# Altium schematic sheet EFR32BG24_PartA.SchDoc: LPEDT_Project_Schematic
size A; Revision: 1; SheetNumber: 7; SheetTotal: 7
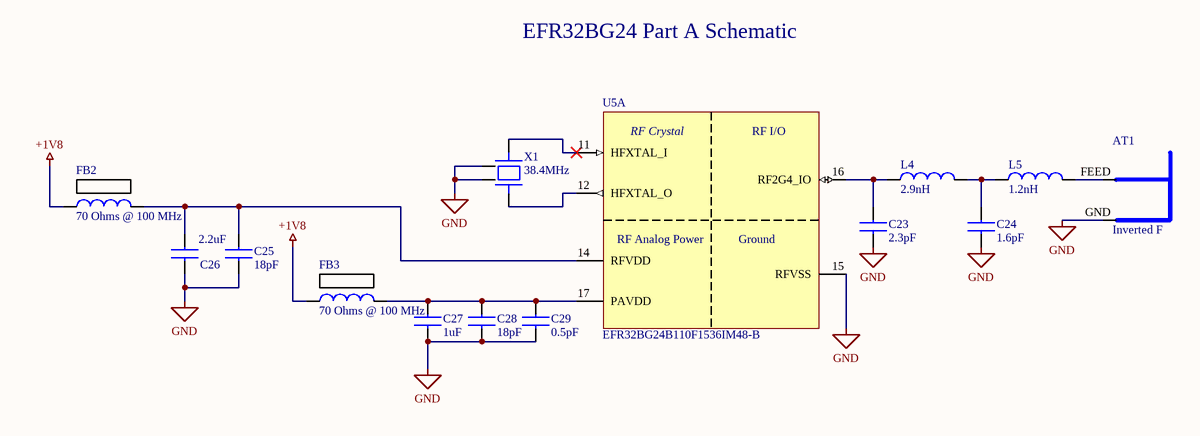
[diagram p0: EFR32BG24_PartA.SchDoc]

## Parts
AT1  Inverted F  [F_ANT]
C23  2.3pF  [C_0402]
C24  1.6pF  [C_0402]
C25  18pF  [C_0603]
C26  2.2uF  [C_0603]
C27  1uF  [C_0603]
C28  18pF  [C_0603]
C29  0.5pF  [C_0603]
FB2  70 Ohms @ 100 MHz  [FB_0603]
FB3  70 Ohms @ 100 MHz  [FB_0603]
L4  2.9nH  [L_0402]
L5  1.2nH  [L_0402]
U5  EFR32BG24B110F1536IM48-B  [U_48QFN_6x6_2]  (part A of 3)
X1  38.4MHz  [33Mhz Crystal]

## Nets
+1V8: FB2.1 FB3.1
GND: AT1.GND C23.2 C24.2 C25.2 C26.2 C27.2 C28.2 C29.2 U5.15(RFVSS) X1.2 X1.4
NetAT1_FEED: AT1.FEED L5.2
NetC23_1: C23.1 L4.1 U5.16(RF2G4_IO)
NetC24_1: C24.1 L4.2 L5.1
NetC25_1: C25.1 C26.1 FB2.2 U5.14(RFVDD)
NetC27_1: C27.1 C28.1 C29.1 FB3.2 U5.17(PAVDD)
NetU5_11: U5.11(HFXTAL_I) X1.3
NetU5_12: U5.12(HFXTAL_O) X1.1

## Notes on the sheet
- EFR32BG24 Part A Schematic
- (in symbol EFR32BG24B110F1536IM48-B, part A) RF Crystal; RF I/O; RF Analog Power; Ground

## Library data of the parts
AT1 = Antenna
C23 = C_2P3_0402: Ceramic Capacitor, Multilayer, Ceramic, 50V, 4.35% +Tol, 4.35% -Tol, C0G, 30ppm/Cel TC, 0.0000023uF, Surface Mount, 0402; Manufacturer: Murata; Manufacturer Part Number: GJM1555C1H2R3BB01D; Multilayer: Yes; Supplier: Digikey; Supplier Part Number: 490-GJM1555C1H2R3BB01DCT-ND; RoHS: Yes; Category: Ceramic Capacitors; Stock: 30945; Pricing: 1=0.1, 10=0.068, 50=0.0406, 100=0.0319, 500=0.02356, 1000=0.01951, 2500=0.01815, 5000=0.01661 (USD); Mounting Technology: Surface Mount; Pins: 2; Dielectric Material: Ceramic; Package Shape: Rectangular; Case/Package: 0402; Terminal Finish: Nickel; Min Operating Temperature: -55°C; Max Operating Temperature: 125°C; JESD-609 Code: e3; Value: 2.3pF; Capacitor Type: Ceramic; Tolerance  (fill in as +-): 4.35%; Package Style: SMTMeter; Packaging: Tape and Reel; Tolerance (fill in as +-): 4.35%; Rated DC Voltage (URdc): 50V; Temperature Characteristics Code: C0G; Termination: Wraparound; Length: 1mm; Width: 0.5mm; Height: 0.5mm; Reach SVHC Compliant: Yes; RoHS Compliant: Yes; ComponentLink1URL: https://datasheet.ciiva.com:443/pdfs/VipMasterIC/IC/MURE/MURE-S-A0004378008/MURE-S-A0004382787-1.pdf?src-supplier=IHS+Markit; ComponentLink1Description: https://datasheet.ciiva.com:443/pdfs/VipMasterIC/IC/MURE/MURE-S-A0004378008/MURE-S-A0004382787-1.pdf?src-supplier=IHS+Markit; ComponentLink2URL: https://datasheet.ciiva.com/166/product-166998.pdf?src-supplier=Digikey; ComponentLink2Description: https://datasheet.ciiva.com/166/product-166998.pdf?src-supplier=Digikey
C24 = C_1P6_0402: Ceramic Capacitor, Multilayer, Ceramic, 50V, 15.62% +Tol, 15.62% -Tol, C0G, 30ppm/Cel TC, 0.0000016uF, Surface Mount, 0402; Manufacturer: Murata; Manufacturer Part Number: GJM1555C1H1R6CB01D; Multilayer: Yes; Supplier: Digikey; Supplier Part Number: 490-3088-1-ND; RoHS: Yes; Category: Ceramic Capacitors; Stock: 26859; Pricing: 1=0.1, 10=0.047, 50=0.0272, 100=0.0211, 500=0.01586, 1000=0.01246, 2500=0.01133, 5000=0.01042 (USD); Mounting Technology: Surface Mount; Pins: 2; Dielectric Material: Ceramic; Package Shape: Rectangular; Case/Package: 0402; Terminal Finish: Nickel; Min Operating Temperature: -55°C; Max Operating Temperature: 125°C; JESD-609 Code: e3; Value: 1.6pF; Capacitor Type: Ceramic; Tolerance  (fill in as +-): 15.62%; Package Style: SMTMeter; Packaging: Tape and Reel; Tolerance (fill in as +-): 15.62%; Rated DC Voltage (URdc): 50V; Temperature Characteristics Code: C0G; Termination: Wraparound; Length: 1mm; Width: 0.5mm; Height: 0.5mm; Reach SVHC Compliant: Yes; RoHS Compliant: Yes; ComponentLink1URL: https://datasheet.ciiva.com:443/pdfs/VipMasterIC/IC/MURE/MURE-S-A0004378008/MURE-S-A0004382877-1.pdf?src-supplier=IHS+Markit; ComponentLink1Description: https://datasheet.ciiva.com:443/pdfs/VipMasterIC/IC/MURE/MURE-S-A0004378008/MURE-S-A0004382877-1.pdf?src-supplier=IHS+Markit; ComponentLink2URL: https://datasheet.ciiva.com/161/product-161712.pdf?src-supplier=Digikey; ComponentLink2Description: https://datasheet.ciiva.com/161/product-161712.pdf?src-supplier=Digikey; ComponentLink3URL: https://datasheet.ciiva.com/16440/gjm1555c1h1r6cb01d-16440474.pdf?src-supplier=Future+Electronics; ComponentLink3Description: https://datasheet.ciiva.com/16440/gjm1555c1h1r6cb01d-16440474.pdf?src-supplier=Future+Electronics; ComponentLink4URL: https://datasheet.ciiva.com/161/partnumbering-e-01-161713.pdf?src-supplier=Digikey; ComponentLink4Description: https://datasheet.ciiva.com/161/partnumbering-e-01-161713.pdf?src-supplier=Digikey; ComponentLink5URL: https://datasheet.ciiva.com/161/partnumbering-e-01-161714.pdf?src-supplier=Digikey; ComponentLink5Description: https://datasheet.ciiva.com/161/partnumbering-e-01-161714.pdf?src-supplier=Digikey
C25 C28 = C_18P_0603: Ceramic Capacitor, Multilayer, Ceramic, 50V, 5% +Tol, 5% -Tol, C0G, 30ppm/Cel TC, 0.000018uF, Surface Mount, 0603; Manufacturer: KEMET; Manufacturer Part Number: C0603C180J5GACTU; Multilayer: Yes; Supplier: Digikey; Supplier Part Number: 399-C0603C180J5GAC7867CT-ND; RoHS: Yes; Category: Ceramic Capacitors; Stock: 391868; Pricing: 1=0.1, 10=0.037, 50=0.0212, 100=0.0164, 500=0.01238, 1000=0.00972 (USD); Mounting Technology: Surface Mount; Pins: 2; Dielectric Material: Ceramic; Package Shape: Rectangular; Case/Package: 0603; Terminal Finish: Nickel; Min Operating Temperature: -55°C; Max Operating Temperature: 125°C; JESD-609 Code: e3; Value: 18pF; Capacitor Type: Ceramic; Tolerance  (fill in as +-): 5%; Package Style: SMTMeter; Packaging: Tape and Reel; Tolerance (fill in as +-): 5%; Rated DC Voltage (URdc): 50V; Temperature Characteristics Code: C0G; Termination: Wraparound; Length: 1.6mm; Width: 0.8mm; Height: 0.8mm; Reach SVHC Compliant: Yes; RoHS Compliant: Yes; ComponentLink1URL: https://datasheet.ciiva.com:443/pdfs/VipMasterIC/IC/KEME/KEME-S-A0007622587/KEME-S-A0007623064-1.pdf?src-supplier=IHS+Markit; ComponentLink1Description: https://datasheet.ciiva.com:443/pdfs/VipMasterIC/IC/KEME/KEME-S-A0007622587/KEME-S-A0007623064-1.pdf?src-supplier=IHS+Markit; ComponentLink2URL: https://datasheet.ciiva.com/7824/1372242-7824010.pdf?src-supplier=Element14; ComponentLink2Description: https://datasheet.ciiva.com/7824/1372242-7824010.pdf?src-supplier=Element14; ComponentLink3URL: https://datasheet.ciiva.com/7824/f9080b-0402-series-c0g-7824009.pdf?src-supplier=Element14; ComponentLink3Description: https://datasheet.ciiva.com/7824/f9080b-0402-series-c0g-7824009.pdf?src-supplier=Element14
C26 = C_2U2_0603: Ceramic Capacitor, Multilayer, Ceramic, 10V, 10% +Tol, 10% -Tol, X7R, 15% TC, 2.2uF, Surface Mount, 0603; Manufacturer: Samsung; Manufacturer Part Number: CL10B225KP8NNNC; Multilayer: Yes; Supplier: Digikey; Supplier Part Number: 1276-1134-1-ND; RoHS: Yes; Category: Ceramic Capacitors; Stock: 1035354; Pricing: 1=0.1, 10=0.07, 50=0.0418, 100=0.0329, 500=0.02428, 1000=0.0201 (USD); Mounting Technology: Surface Mount; Pins: 2; Dielectric Material: Ceramic; Package Shape: Rectangular; Case/Package: 0603; Terminal Finish: Nickel; Min Operating Temperature: -55°C; Max Operating Temperature: 125°C; JESD-609 Code: e3; Value: 2.2uF; Capacitor Type: Ceramic; Tolerance  (fill in as +-): 10%; Package Style: SMTMeter; Packaging: Tape and Reel; Tolerance (fill in as +-): 10%; Rated DC Voltage (URdc): 10V; Temperature Characteristics Code: X7R; Termination: Wraparound; Length: 1.6mm; Width: 0.8mm; Height: 0.9mm; Reach SVHC Compliant: Yes; RoHS Compliant: Yes; ComponentLink1URL: https://datasheet.ciiva.com:443/pdfs/VipMasterIC/IC/SEMS/SEMS-S-A0008384515/SEMS-S-A0008873307-1.pdf?src-supplier=IHS+Markit; ComponentLink1Description: https://datasheet.ciiva.com:443/pdfs/VipMasterIC/IC/SEMS/SEMS-S-A0008384515/SEMS-S-A0008873307-1.pdf?src-supplier=IHS+Markit; ComponentLink2URL: https://datasheet.ciiva.com/15227/getdatasheetpartid-359568-15227195.pdf?src-supplier=Verical; ComponentLink2Description: https://datasheet.ciiva.com/15227/getdatasheetpartid-359568-15227195.pdf?src-supplier=Verical; ComponentLink3URL: https://datasheet.ciiva.com/25798/cl10b225kp8nnnc-25798914.pdf?src-supplier=Digikey; ComponentLink3Description: https://datasheet.ciiva.com/25798/cl10b225kp8nnnc-25798914.pdf?src-supplier=Digikey; ComponentLink4URL: https://datasheet.ciiva.com/16500/cl10b225kp8nnnc-16500695.pdf?src-supplier=Future+Electronics; ComponentLink4Description: https://datasheet.ciiva.com/16500/cl10b225kp8nnnc-16500695.pdf?src-supplier=Future+Electronics; ComponentLink5URL: https://datasheet.ciiva.com/29198/457933-da-01-en-vs-kondensator-0603-29198589.pdf?src-supplier=Conrad; ComponentLink5Description: https://datasheet.ciiva.com/29198/457933-da-01-en-vs-kondensator-0603-29198589.pdf?src-supplier=Conrad
C27 = C_1U_0603: CAP CER 1UF 10V X5R 0603; Manufacturer: Murata; Manufacturer Part Number: GRM188R61A105KA61D; Dielectric Material: Ceramic; Multilayer: Yes; Tolerance  (fill in as +-): 10%; Supplier: Digikey; Supplier Part Number: 490-1543-1-ND; RoHS: Yes; Category: Ceramic Capacitors; Stock: 1314759; Pricing: 1=0.12, 10=0.08, 50=0.048, 100=0.0378, 500=0.02794, 1000=0.02313 (USD); Mounting Technology: Surface Mount; Pins: 2; Package Shape: Rectangular; Case/Package: 0603; Terminal Finish: Nickel; Min Operating Temperature: -55°C; Max Operating Temperature: 85°C; JESD-609 Code: e3; Value: 1uF; Capacitor Type: Ceramic; Package Style: SMTMeter; Packaging: Tape and Reel; Tolerance (fill in as +-): 10%; Rated DC Voltage (URdc): 10V; Temperature Characteristics Code: X5R; Termination: Wraparound; Length: 1.6mm; Width: 0.8mm; Height: 0.8mm; Reach SVHC Compliant: Yes; RoHS Compliant: Yes; ComponentLink1URL: https://psearch.en.murata.com:443/capacitor/product/GRM188R61A105KA61%23.pdf?src-supplier=IHS+Markit; ComponentLink1Description: https://psearch.en.murata.com:443/capacitor/product/GRM188R61A105KA61%23.pdf?src-supplier=IHS+Markit; ComponentLink2URL: https://datasheet.ciiva.com/19476/1857381-19476568.pdf?src-supplier=Jameco; ComponentLink2Description: https://datasheet.ciiva.com/19476/1857381-19476568.pdf?src-supplier=Jameco; ComponentLink3URL: https://datasheet.ciiva.com/18102/getdatasheetpartid-85467-18102910.pdf?src-supplier=Verical; ComponentLink3Description: https://datasheet.ciiva.com/18102/getdatasheetpartid-85467-18102910.pdf?src-supplier=Verical; ComponentLink4URL: https://datasheet.ciiva.com/7719/608985-7719036.pdf?src-supplier=Element14; ComponentLink4Description: https://datasheet.ciiva.com/7719/608985-7719036.pdf?src-supplier=Element14; ComponentLink5URL: https://datasheet.ciiva.com/22706/608985-22706782.pdf?src-supplier=Element14; ComponentLink5Description: https://datasheet.ciiva.com/22706/608985-22706782.pdf?src-supplier=Element14; ComponentLink6URL: https://datasheet.ciiva.com/131/partnumbering-e-01-131742.pdf?src-supplier=Digikey; ComponentLink6Description: https://datasheet.ciiva.com/131/partnumbering-e-01-131742.pdf?src-supplier=Digikey; ComponentLink7URL: https://datasheet.ciiva.com/131/partnumbering-e-01-131741.pdf?src-supplier=Digikey; ComponentLink7Description: https://datasheet.ciiva.com/131/partnumbering-e-01-131741.pdf?src-supplier=Digikey; ComponentLink8URL: https://datasheet.ciiva.com/131/partnumbering-e-01-131743.pdf?src-supplier=Digikey; ComponentLink8Description: https://datasheet.ciiva.com/131/partnumbering-e-01-131743.pdf?src-supplier=Digikey; ComponentLink9URL: https://datasheet.ciiva.com/16199/product-16199724.pdf?src-supplier=Future+Electronics; ComponentLink9Description: https://datasheet.ciiva.com/16199/product-16199724.pdf?src-supplier=Future+Electronics
C29 = C_0P5_0603: Cap Cer 0.5PF 250V C0G/NP0 0603; Manufacturer: Johanson; Manufacturer Part Number: QSCP251Q0R5A1GV001T; Supplier: Digikey; Supplier Part Number: 712-QSCP251Q0R5A1GV001TCT-ND; RoHS: No; Category: Ceramic Capacitors; Stock: 12633; Pricing: 1=0.36, 10=0.237, 50=0.1746, 100=0.1422, 500=0.11226, 1000=0.0948 (USD)
FB2 FB3 = BLM18SG700TN1D: Ferrite Chip, 1 Function(s), 4A, 2 Pin(s); Manufacturer: Murata; DC Resistance-Max: 20mR; Clock Frequency: 100MHz; Channels: 1; Output Impedance: 70R; Supplier: Digikey; Supplier Part Number: 490-5224-1-ND; Manufacturer Part Number: BLM18SG700TN1D; RoHS: Yes; Category: Ferrite Beads and Chips; Stock: 330015; Pricing: 1=0.13, 10=0.109, 25=0.0848, 50=0.0702, 100=0.0605, 250=0.0484, 500=0.04356, 1000=0.03631, 5000=0.03389 (USD); Mounting Technology: Surface Mount; Material: Ferrite; Case Code: 0603; Terminal Finish: Tin; Min Operating Temperature: -55°C; Max Operating Temperature: 125°C; JESD-609 Code: e3; Construction: Chip Bead; Filter Type: FERRITE CHIP; Min Frequency: 100MHz; Packaging: Tape and Reel; Current Rating: 4A; Length: 1.6mm; Width: 0.8mm; Height: 0.5mm; Reach SVHC Compliant: Yes; RoHS Compliant: Yes; ComponentLink1URL: https://datasheet.ciiva.com:443/pdfs/VipMasterIC/IC/MURE/MURE-S-A0008515766/MURE-S-A0008515869-1.pdf?src-supplier=IHS+Markit; ComponentLink1Description: https://datasheet.ciiva.com:443/pdfs/VipMasterIC/IC/MURE/MURE-S-A0008515766/MURE-S-A0008515869-1.pdf?src-supplier=IHS+Markit; ComponentLink2URL: https://datasheet.ciiva.com/41449/001171727-da-01-en-chip-drossel0603-70r-4000ma-1-6x0-8mm-41449356.pdf?src-supplier=Conrad; ComponentLink2Description: https://datasheet.ciiva.com/41449/001171727-da-01-en-chip-drossel0603-70r-4000ma-1-6x0-8mm-41449356.pdf?src-supplier=Conrad; ComponentLink3URL: https://datasheet.ciiva.com/41449/001172316-da-01-en-drossel-0603-70r-1-6x0-8mm-10000st-41449678.pdf?src-supplier=Conrad; ComponentLink3Description: https://datasheet.ciiva.com/41449/001172316-da-01-en-drossel-0603-70r-1-6x0-8mm-10000st-41449678.pdf?src-supplier=Conrad; ComponentLink4URL: https://datasheet.ciiva.com/8021/5151-8021530.pdf?src-supplier=Element14; ComponentLink4Description: https://datasheet.ciiva.com/8021/5151-8021530.pdf?src-supplier=Element14; ComponentLink5URL: https://datasheet.ciiva.com/14122/blm-series-eng-tds-14122901.pdf?src-supplier=Distrelec; ComponentLink5Description: https://datasheet.ciiva.com/14122/blm-series-eng-tds-14122901.pdf?src-supplier=Distrelec; ComponentLink6URL: https://datasheet.ciiva.com/8021/5151-8021529.pdf?src-supplier=Element14; ComponentLink6Description: https://datasheet.ciiva.com/8021/5151-8021529.pdf?src-supplier=Element14; ComponentLink7URL: https://datasheet.ciiva.com/6212/l0110s0100blm18s-6212357.pdf?src-supplier=Digikey; ComponentLink7Description: https://datasheet.ciiva.com/6212/l0110s0100blm18s-6212357.pdf?src-supplier=Digikey
L4 = L_2N9_0402: General Purpose Inductor, 0.0029uH, 10.345%, 1 Element, SMD, 0402; Manufacturer: Murata; Manufacturer Part Number: LQG15WZ2N9S02D; Supplier: Digikey; Supplier Part Number: 490-LQG15WZ2N9S02DCT-ND; RoHS: Yes; Category: Fixed Inductors; Stock: 19729; Pricing: 1=0.12, 10=0.099, 25=0.0912, 50=0.0804, 100=0.0703, 250=0.06696, 500=0.06294, 1000=0.0482, 2500=0.04553 (USD)
L5 = L_1N2_0402: General Purpose Inductor, 0.0012uH, 8.333%, 1 Element, SMD, 0402; Manufacturer: Murata; Manufacturer Part Number: LQG15HS1N2B02D; DC Resistance (DCR): 70mR; Inductor Application: RF INDUCTOR; Channels: 1; Quality Factor-Min (at L-nom): 8; Max Current Rating: 1A; Self Resonant Frequency: 6GHz; Shape/Size Description: RECTANGULAR PACKAGE; Shielding: Unshielded; Test Frequency: 100MHz; Supplier: Digikey; Supplier Part Number: 490-LQG15HS1N2B02DCT-ND; RoHS: Yes; Category: Fixed Inductors; Stock: 9740; Pricing: 1=0.1, 10=0.065, 25=0.0596, 50=0.0526, 100=0.046, 250=0.04376, 500=0.04114, 1000=0.03152, 2500=0.02977 (USD); Pins: 2; Terminal Finish: Tin; Min Operating Temperature: -55°C; Max Operating Temperature: 125°C; Tolerance: 8.333%; JESD-609 Code: e3; Inductance-Nom (L): 0.0012uH; Inductor Type: GENERAL PURPOSE INDUCTOR; Surface Mount: Yes; Terminal Placement: Dual Ended; Termination: Wraparound; Reach SVHC Compliant: Yes; RoHS Compliant: Yes; ComponentLink1URL: https://psearch.en.murata.com:443/inductor/product/LQG15HS1N2B02_.pdf?src-supplier=IHS+Markit; ComponentLink1Description: https://psearch.en.murata.com:443/inductor/product/LQG15HS1N2B02_.pdf?src-supplier=IHS+Markit
U5 = EFR32BG24B110F1536IM48-B: BG24, 2.4 GHz, 1536kB Flash, 256kB RAM, +10 dBm, Secure Vault High, 20-bit ADC +125C, QFN48; Manufacturer: Silicon Labs; Supplier: Digikey; Supplier Part Number: 336-EFR32BG24B110F1536IM48-B-ND; Manufacturer Part Number: EFR32BG24B110F1536IM48-B; RoHS: No; Category: RF Receivers, Transceivers; Stock: 2713; Pricing: 1=7.9, 10=7.244, 25=6.5852, 80=5.92663, 230=5.43278, 490=4.9389, 980=4.44501 (USD)
X1 = X_39M_0302: Parallel - Fundamental Quartz Crystal, 38.4MHz Nom; Manufacturer: Raltron Electronics; Manufacturer Part Number: RH100-38.400-10-F-1010-TR; Supplier: Digikey; Supplier Part Number: 2151-RH100-38.400-10-F-1010-TRCT-ND; RoHS: Yes; Category: Crystals and Oscillators; Stock: 14924; Pricing: 1=0.24, 10=0.203, 50=0.1828, 100=0.1625, 500=0.15442, 1000=0.13004 (USD)